# EasyEDA Pro project ProProject_Hi3861_v2.1_2024-07-26.epro, schematic Schematic3

## Sheets
1 P1: Create Date: 2024-07-16; Page Name: P1; Project Name: Hi3861_v2.1; Schematic Name: Schematic3; Update Date: 2024-07-16; Company: 嘉立创EDA; Page Size: A4; Version: V1.0
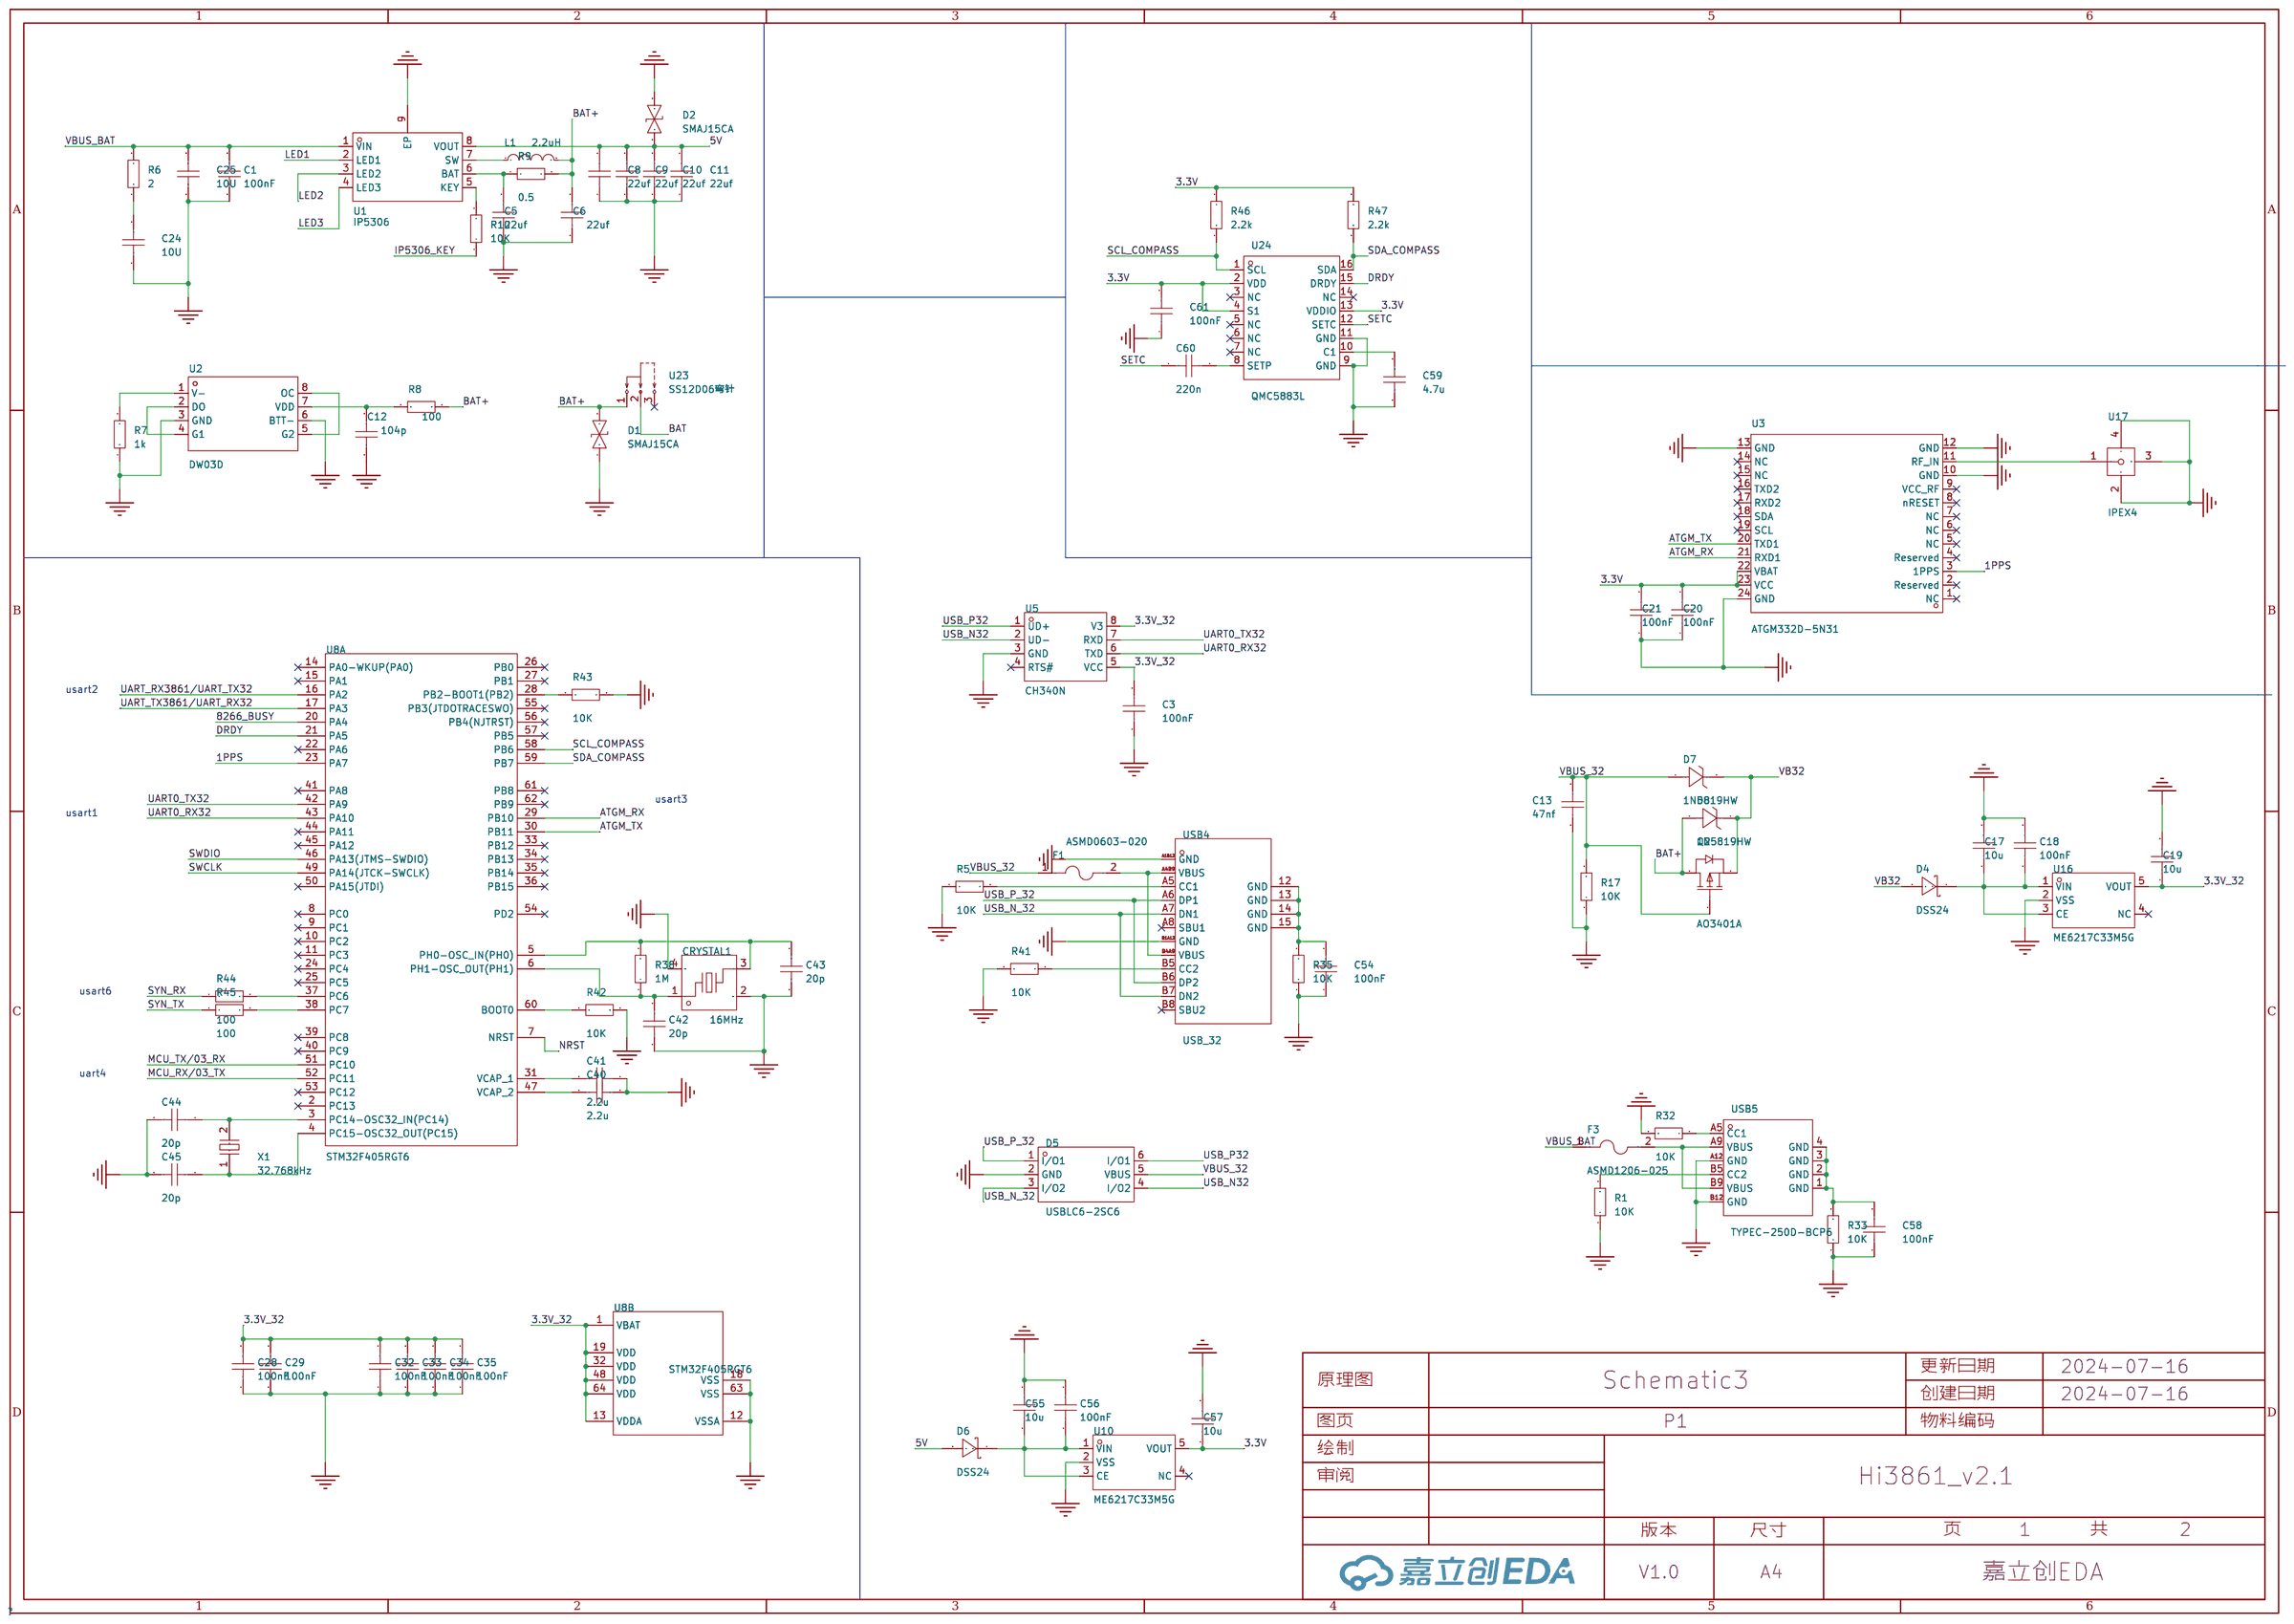
[diagram p4: P1]
2 P2: Page Name: P2
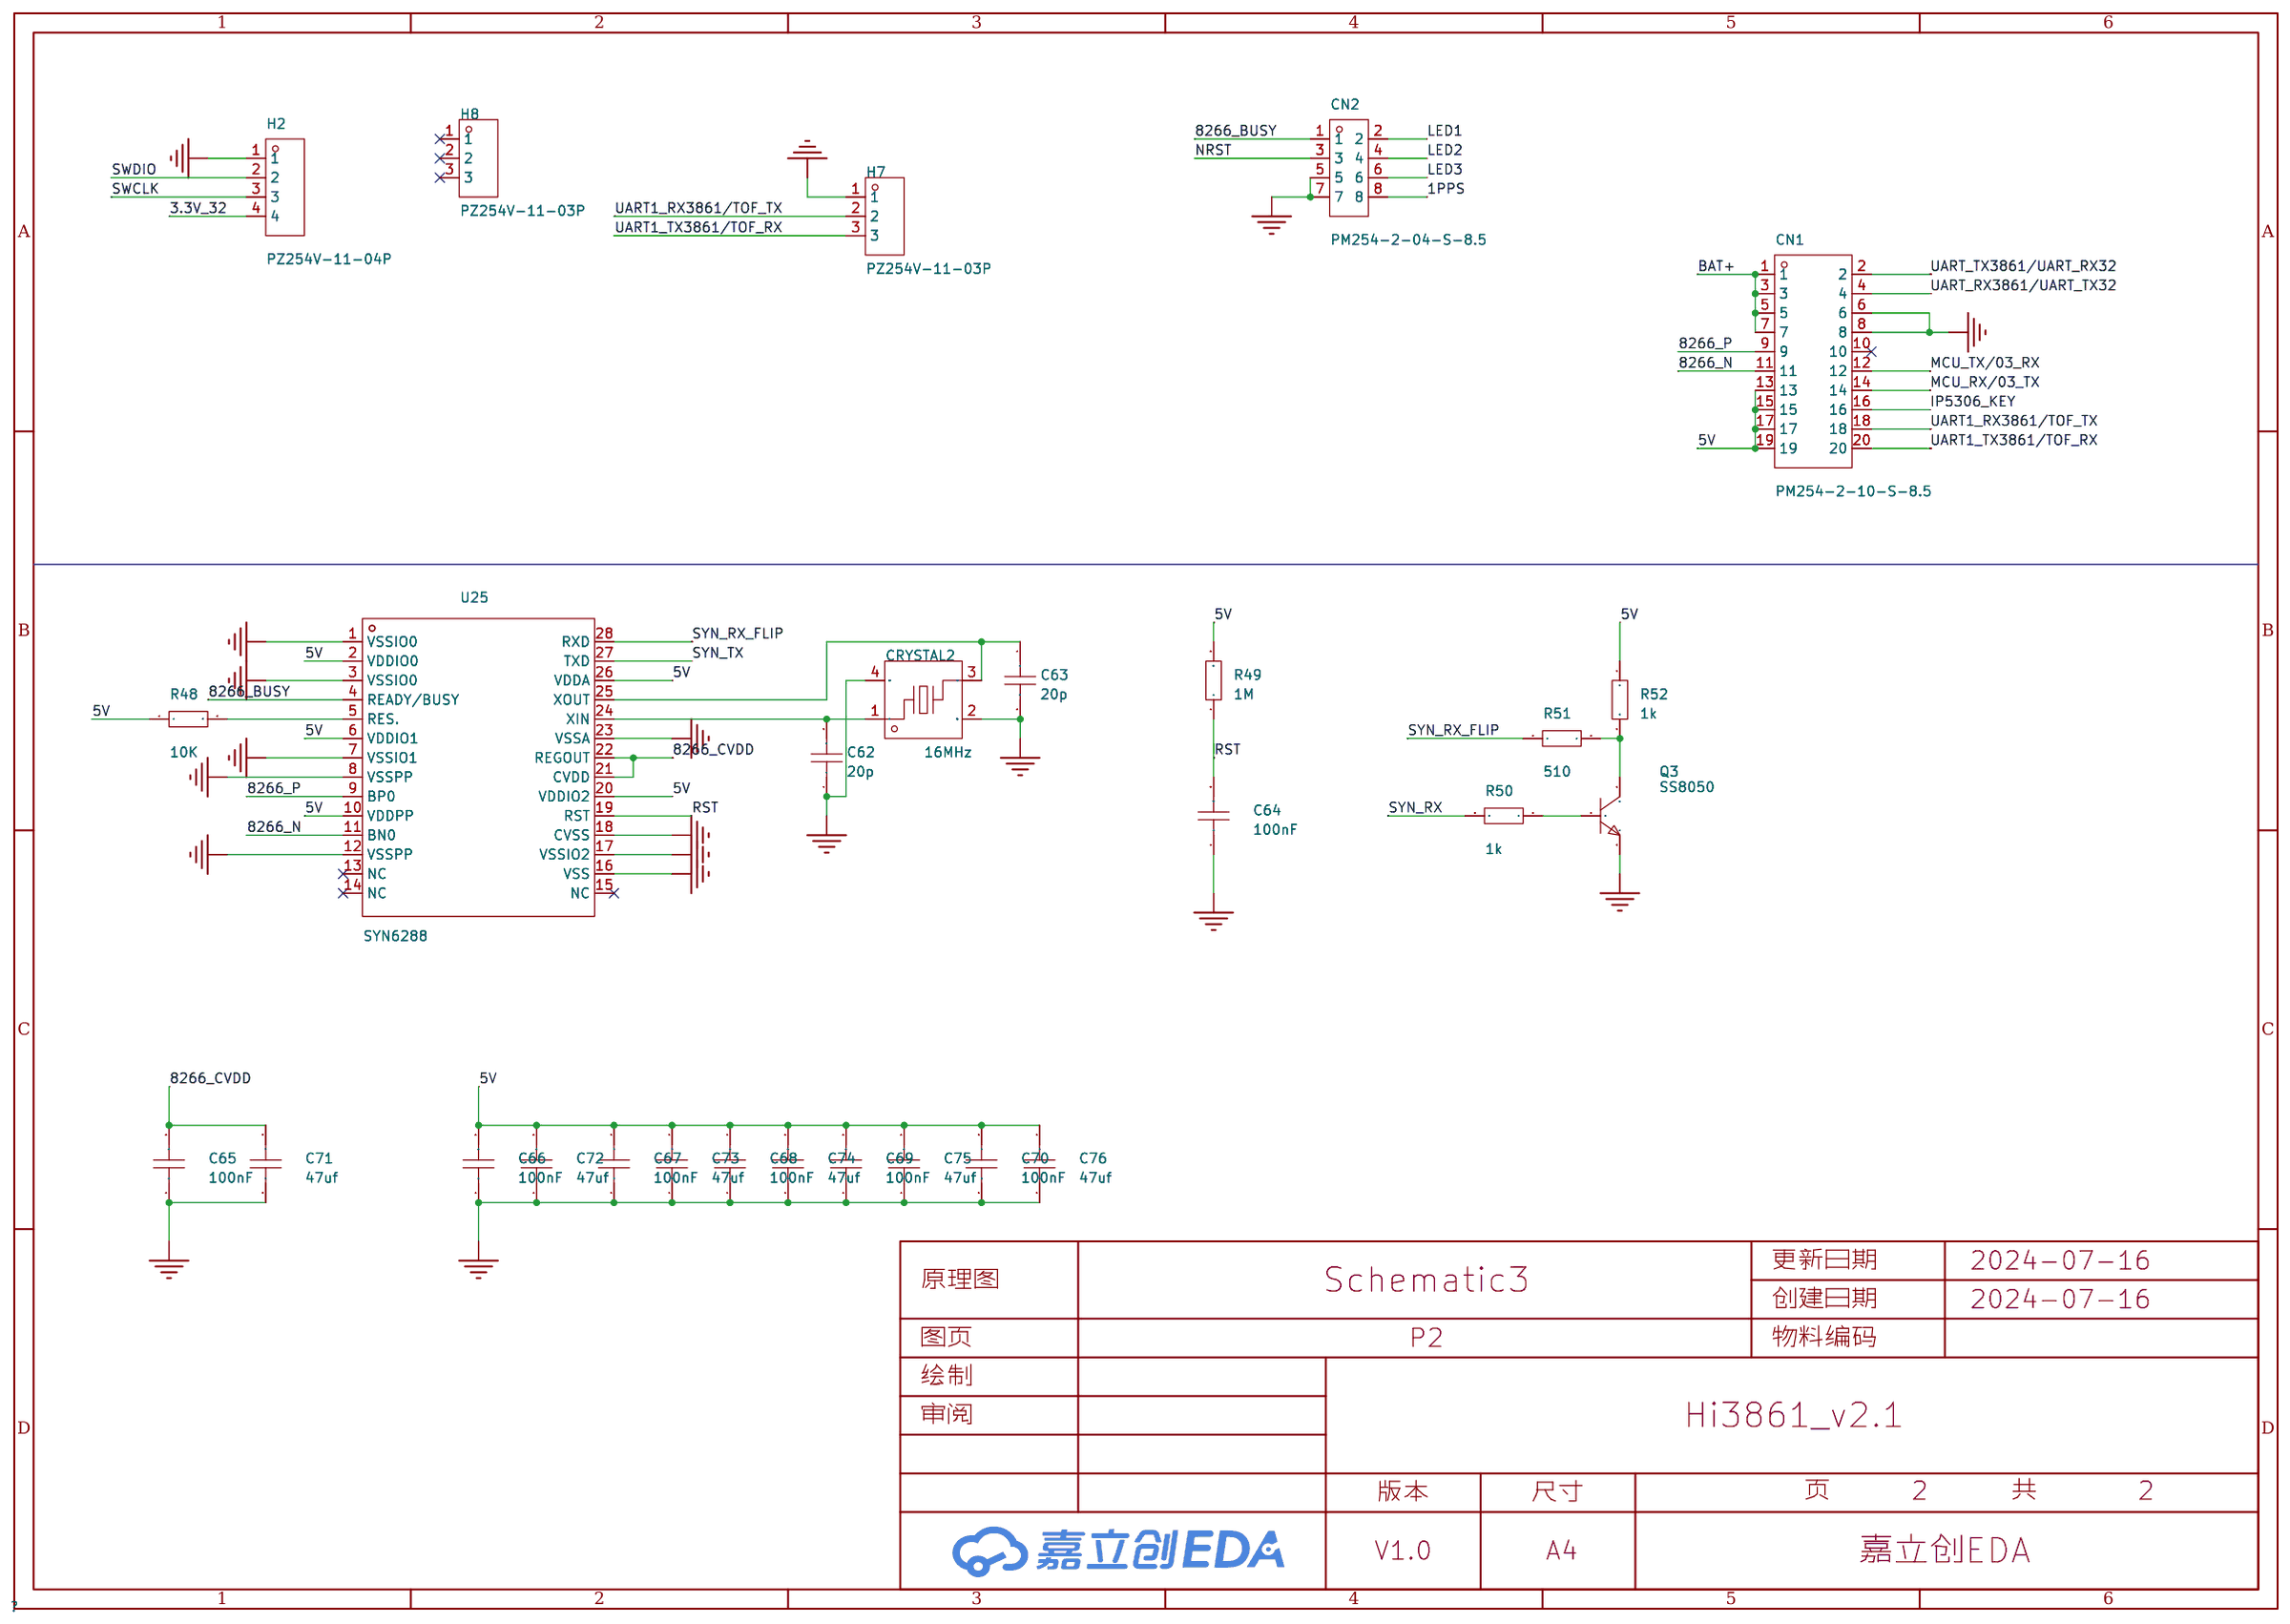
[diagram p5: P2]

## Parts
sheet P1
C1  100nF  [C0402]
C3  100nF  [C0402]
C5  22uf  [C1206]
C6  22uf  [C1206]
C8  22uf  [C1206]
C9  22uf  [C1206]
C10  22uf  [C1206]
C11  22uf  [C1206]
C12  104p  [C0402]
C13  47nf  [C0402]
C17  10u  [C0402]
C18  100nF  [C0402]
C19  10u  [C0402]
C20  100nF  [C0402]
C21  100nF  [C0402]
C24  10U  [C0603]
C25  10U  [C0603]
C28  100nF  [C0402]
C29  100nF  [C0402]
C32  100nF  [C0402]
C33  100nF  [C0402]
C34  100nF  [C0402]
C35  100nF  [C0402]
C40  2.2u  [C0402]
C41  2.2u  [C0402]
C42  20p  [C0402]
C43  20p  [C0402]
C44  20p  [C0402]
C45  20p  [C0402]
C54  100nF  [C0402]
C55  10u  [C0402]
C56  100nF  [C0402]
C57  10u  [C0402]
C58  100nF  [C0402]
C59  4.7u  [C0603]
C60  220n  [C0402]
C61  100nF  [C0402]
CRYSTAL1  16MHz  [CRYSTAL-SMD_4P-L3.2-W2.5-BL_SIT8008BI]
D1  SMAJ15CA  [SMA_L4.3-W2.7-LS5.1-BI]
D2  SMAJ15CA  [SMA_L4.3-W2.7-LS5.1-BI]
D4  DSS24  [SOD-123_L2.8-W1.8-LS3.7-RD]
D5  USBLC6-2SC6  [SOT-23-6_L2.9-W1.6-P0.95-LS2.8-BL]
D6  DSS24  [SOD-123_L2.8-W1.8-LS3.7-RD]
D7  1N5819HW  [SOD-123_L2.7-W1.6-LS3.7-RD-1]
D8  1N5819HW  [SOD-123_L2.7-W1.6-LS3.7-RD-1]
F1  ASMD0603-020  [F0603]
F3  ASMD1206-025  [F1206]
L1  2.2uH  [IND-SMD_L7.0-W6.6_MCW-0650-220]
Q2  AO3401A  [SOT-23_L2.9-W1.3-P1.90-LS2.4-BR]
R1  10K  [R0402]
R5  10K  [R0402]
R6  2  [R0402]
R7  1k  [R0402]
R8  100  [R0402]
R9  0.5  [R0603]
R10  10K  [R0603]
R17  10K  [R0402]
R32  10K  [R0402]
R33  10K  [R0402]
R35  10K  [R0402]
R38  1M  [R0402]
R41  10K  [R0402]
R42  10K  [R0402]
R43  10K  [R0402]
R44  100  [R0402]
R45  10K  [R0402]
R46  2.2k  [R0402]
R47  2.2k  [R0402]
U1  IP5306  [ESOP-8_L4.9-W3.9-P1.27-LS6.0-BL-EP]
U2  DW03D  [TSSOP-8_L4.4-W3.0-P0.65-LS6.4-BL]
U3  ATGM332D-5N31  [GSM-SMD_ATGM332D-5N31]
U5  CH340N  [SOP-8_L4.9-W3.9-P1.27-LS6.0-BL]
U8  STM32F405RGT6  [LQFP-64_L10.0-W10.0-P0.50-LS12.0-BL]  (sections 1,2)
U10  ME6217C33M5G  [SOT-23-5_L3.0-W1.7-P0.95-LS2.8-BR]
U16  ME6217C33M5G  [SOT-23-5_L3.0-W1.7-P0.95-LS2.8-BR]
U17  IPEX4  [IPEX-SMD_4P-L1.8-W1.7-LS2.0-1]
U23  SS12D06弯针  [SW-TH_3P-SS12D06-1]
U24  QMC5883L  [LGA-16_L3.0-W3.0-P0.50-BL_SQ]
USB4  USB_32  [USB-SMD_TYPEC-16PIN]
USB5  TYPEC-250D-BCP6  [USB-C-SMD_TYPEC-250D-BCP6]
X1  32.768kHz  [CRYSTAL-SMD_L3.2-W1.5-1]
sheet P2
C62  20p  [C0402]
C63  20p  [C0402]
C64  100nF  [C0402]
C65  100nF  [C0402]
C66  100nF  [C0402]
C67  100nF  [C0402]
C68  100nF  [C0402]
C69  100nF  [C0402]
C70  100nF  [C0402]
C71  47uf  [C1206]
C72  47uf  [C1206]
C73  47uf  [C1206]
C74  47uf  [C1206]
C75  47uf  [C1206]
C76  47uf  [C1206]
CN1  PM254-2-10-S-8.5  [HDR-SMD_20P-P2.54-V-F-R2-C10-S2.54-LS7.1]
CN2  PM254-2-04-S-8.5  [HDR-SMD_8P-P2.54-V-F-R2-C4-S7.1]
CRYSTAL2  16MHz  [CRYSTAL-SMD_4P-L3.2-W2.5-BL_SIT8008BI]
H2  PZ254V-11-04P  [HDR-TH_4P-P2.54-V-M]
H7  PZ254V-11-03P  [HDR-TH_3P-P2.54-V-M]
H8  PZ254V-11-03P  [HDR-TH_3P-P2.54-V-M]
Q3  SS8050  [SOT-23-3_L2.9-W1.3-P1.90-LS2.4-BR]
R48  10K  [R0402]
R49  1M  [R0402]
R50  1k  [R0402]
R51  510  [R0402]
R52  1k  [R0402]
U25  SYN6288  [SSOP-28_L10.2-W5.3-P0.65-LS7.8-BL]

## Library data of the parts
C1 C3 C12 C13 C17-C21 C28 C29 C32-C35 C40-C45 C54-C58 C60-C70 = CAP_0402: Supplier Footprint: 0402
C5 C6 C8-C11 C71-C76 = CAP_1206: Supplier Footprint: 1206
C24 C25 C59 = CAP_0603: Supplier Footprint: 0603
CRYSTAL1 CRYSTAL2 = CF4008M00012001: 晶振类型:贴片晶振;频率:8MHz;常温频差:±10ppm;外接负载电容:12pF;频率稳定度(全温):±30ppm;; LCSC Part Name: 8MHz ±10ppm 12pF; Supplier Part: C7294546; Manufacturer: HUAXIN(华昕); Supplier Footprint: SMD-3225-4P; Datasheet: https://atta.szlcsc.com/upload/public/pdf/source/20230614/403FD538918E19EFAFACD07D4A487DFF.pdf; Supplier: LCSC; Crystal Type: 贴片晶振; Normal temperature Frequency Tolerance: ±10ppm; External load capacitor: 12pF; Frequency Stability(Full temperature range): ±30ppm; Equivalent Series Resistance (ESR): 40Ω; Operating Temperature: -40℃~+85℃
D1 D2 = SMAJ15CA_C908195: 反向截止电压(Vrwm):15V;最大钳位电压:24.4V;峰值脉冲电流(Ipp)@10/1000us:16.4A;击穿电压:16.7V;; LCSC Part Name: 双向TVS 15V截止 16.4A峰值脉冲; Supplier Part: C908195; Manufacturer: FUXINSEMI(富芯森美); Supplier Footprint: SMA(DO-214AC); Datasheet: https://atta.szlcsc.com/upload/public/pdf/source/20201023/C908195_37902766E86D5E1EA357B63C628FE5CE.pdf; Supplier: LCSC; Reverse Stand-Off Voltage (Vrwm): 15V; Maximum Clamping Voltage: 24.4V; Peak Pulse Current (Ipp)@10/1000us: 16.4A; Breakdown Voltage: 16.7V; Reverse Leakage Current (Ir): 5uA; Type: TVS
D4 D6 = DSS24: 正向压降(Vf):550mV@2A;直流反向耐压(Vr):40V;平均整流电流(Io):2A;; LCSC Part Name: 电压:40V 电流:2A; Supplier Part: C511865; Manufacturer: BORN(伯恩半导体); Supplier Footprint: SOD-123; Datasheet: https://atta.szlcsc.com/upload/public/pdf/source/20200413/C511865_530A4A8DFA4BF76EA49400B00C28BC33.pdf; Supplier: LCSC; Forward Voltage (Vf@If): 550mV@2A; Reverse Voltage (Vr): 40V; Average Rectified Current (Io): 2A
D5 = USBLC6-2SC6: 最大钳位电压:15V;击穿电压:6V;; Supplier Part: C2687116; Manufacturer: UMW(友台半导体); Supplier Footprint: SOT-23-6; JLCPCB Part Class: 扩展库; Datasheet: https://atta.szlcsc.com/upload/public/pdf/source/20231109/512642D850D9873E7C519F71E85B9A10.pdf; Supplier: LCSC; Maximum Clamping Voltage: 15V; Breakdown Voltage: 6V; Number of Lines: 双路; Type: ESD
D7 D8 = 1N5819HW_C5439970: Supplier Part: C5439970; Manufacturer: BORN(伯恩半导体); Supplier Footprint: SOD-123; JLCPCB Part Class: 扩展库; Supplier: LCSC
F1 = ASMD0603-020: 最大电压:9V;最大电流:40A;保持电流:200mA;跳闸电流:500mA;; LCSC Part Name: 9V 200mA 0603自恢复; Supplier Part: C135321; Manufacturer: JDTfuse(集电通); Supplier Footprint: 0603; JLCPCB Part Class: 扩展库; Datasheet: https://atta.szlcsc.com/upload/public/pdf/source/20230515/E3BD72A3B3566E5D91D9E10B82E096BB.pdf; Supplier: LCSC; Operating Voltage (Max): 9V; Current Rating (Max): 40A; Hold Current: 200mA; Trip Current: 500mA; Power Dissipation: 500mW; Resistance - Initial (Ri) (Min): 550mΩ; Resistance - Post Trip (R1) (Max): 3.5Ω; Maximum Time to Trip: 600ms; Operating Temperature: -40℃~+85℃
F3 = ASMD1206-025: 最大电压:16V;最大电流:100A;保持电流:250mA;跳闸电流:500mA;; LCSC Part Name: 16V 250mA 1206自恢复; Supplier Part: C135336; Manufacturer: JDTfuse(集电通); Supplier Footprint: 1206; JLCPCB Part Class: 扩展库; Datasheet: https://atta.szlcsc.com/upload/public/pdf/source/20230515/057C807831823160B78244CFBDC62EBE.pdf; Supplier: LCSC; Operating Voltage (Max): 16V; Current Rating (Max): 100A; Hold Current: 250mA; Trip Current: 500mA; Power Dissipation: 600mW; Resistance - Initial (Ri) (Min): 350mΩ; Resistance - Post Trip (R1) (Max): 2.5Ω; Maximum Time to Trip: 80ms; Operating Temperature: -40℃~+85℃
L1 = MCW-0650-220-N2: 电感值:22uH;精度:±20%;额定电流:2.6A;; LCSC Part Name: 22uH ±20%; Supplier Part: C177257; Manufacturer: Hk-hotline(合泰盟方); Supplier Footprint: SMD,6.6x7mm; Datasheet: https://atta.szlcsc.com/upload/public/pdf/source/20180126/C177257_15169518534351308687.pdf; Supplier: LCSC; Tolerance: ±20%; Rated Current: 2.6A; DC Resistance (DCR): 140mΩ
Q2 = AO3401A_C15127: 类型:1个P沟道;漏源电压(Vdss):30V;连续漏极电流(Id):4A;功率(Pd):1.4W;导通电阻(RDS(on)@Vgs,Id):44mΩ@10V,4.3A;阈值电压(Vgs(th)@Id):1.3V@250uA;; LCSC Part Name: 1个P沟道 耐压:30V 电流:4A; Supplier Part: C15127; Manufacturer: AOS; Supplier Footprint: SOT-23; JLCPCB Part Class: 基础库; Datasheet: https://atta.szlcsc.com/upload/public/pdf/source/20160507/1462613609053.pdf; Supplier: LCSC; Type: 1个P沟道; Drain Source Voltage (Vdss): 30V; Continuous Drain Current (Id): 4A; Power Dissipation (Pd): 1.4W; Drain Source On Resistance (RDS(on)@Vgs,Id): 44mΩ@10V,4.3A; Gate Threshold Voltage (Vgs(th)@Id): 1.3V@250uA; Total Gate Charge (Qg@Vgs): 12.2nC@4.5V; Input Capacitance (Ciss@Vds): 1.2nF@15V; Operating Temperature: -55℃~+150℃@(Tj)
R1 R5-R8 R17 R32 R33 R35 R38 R41-R52 = Res_0402: Supplier Footprint: 0402
R9 R10 = Res_0603: Supplier Footprint: 0603
U1 = IP5306: 2.1A充电2.4A放电高集成度移动电源SOC; Supplier Part: C181692; Manufacturer: INJOINIC(英集芯); Supplier Footprint: ESOP-8; JLCPCB Part Class: 扩展库; Datasheet: https://atta.szlcsc.com/upload/public/pdf/source/20190627/C384572_9925B3DDC4041BC6108E5AB46A2A0AB1.pdf; Supplier: LCSC
U2 = DW03D: 二合一锂电池保护芯片; Supplier Part: C82200; Manufacturer: FM(富满); Supplier Footprint: TSSOP-8; Datasheet: https://atta.szlcsc.com/upload/public/pdf/source/20170814/C82200_1502678439162886029.pdf; Supplier: LCSC
U3 = ATGM332D-5N31: BDS/GNSS 全星座定位导航模块; LCSC Part Name: BDS/GNSS 全星座定位导航模块; Supplier Part: C128659; Manufacturer: 杭州中科微; Supplier Footprint: SMD,12.2x16mm; Datasheet: https://atta.szlcsc.com/upload/public/pdf/source/20171221/C128660_15138310154131195212.pdf; Supplier: LCSC
U5 = CH340N: LCSC Part Name: USB转串口芯片 CH340; Supplier Part: C2977777; Manufacturer: WCH(南京沁恒); Supplier Footprint: SOP-8; Datasheet: https://atta.szlcsc.com/upload/public/pdf/source/20230530/6E401E9554E9F5311886CC8B3F89B62E.pdf; Supplier: LCSC
U8 = STM32F405RGT6: CPU内核:CM4;程序存储容量:1MB;RAM总容量:192KB;GPIO端口数量:51;工作电压范围:1.8V~3.6V;CPU最大主频:168MHz;程序存储器类型:FLASH;; Supplier Part: C15742; Manufacturer: ST(意法半导体); Supplier Footprint: LQFP-64(10x10); Datasheet: https://atta.szlcsc.com/upload/public/pdf/source/20140801/1457707197138.pdf; Supplier: LCSC; CPU Core: CM4; Program Storage Size: 1MB; RAM Size: 192KB; GPIO Ports Number: 51; Operating Voltage Range: 1.8V~3.6V; CPU Maximum Speed: 168MHz; Program Memory Type: FLASH; Operating Temperature Range: -40℃~+85℃; ADC (Bit): 12bit; DAC (Bit): 12bit; Universal Serial Bus: 有; Peripheral/Function: DMA；LCD/LED驱动；PWM; Watchdog: 有; Infrared Data Association: 有; Low-Voltage Detect: 有; LCD Module: 有; Direct Memory Access: 有; Internal Oscillator: 有
U10 U16 = ME6217C33M5G: 输出类型:固定;最大输入电压:7V;输出电压:3.3V;最大输出电流:800mA;电源纹波抑制比(PSRR):65dB@(1kHz);输出极性:正极;; LCSC Part Name: 输入7V 输出3.3V 800mA; Supplier Part: C427602; Manufacturer: MICRONE(南京微盟); Supplier Footprint: SOT-23-5; JLCPCB Part Class: 扩展库; Datasheet: https://atta.szlcsc.com/upload/public/pdf/source/20190910/C427602_D4B9162A2E9D9EF57C60010DFDECEF37.pdf; Supplier: LCSC; Output Type: 固定; Maximum Input Voltage: 7V; Output Voltage: 3.3V; MAX Output Current: 800mA; Power Supply Rejection Ratio (PSRR): 65dB@(1kHz); Dropout Voltage: 180mV@(300mA); Output Polarity: 正极; Number of Outputs: 1
U17 = IPEX4: Supplier Part: C9900016189; JLCPCB Part Class: 扩展库; Supplier: LCSC
U23 = SS12D06弯针: Supplier Part: C9900027365; Supplier Footprint: THrough hole; JLCPCB Part Class: 扩展库; Supplier: LCSC
U24 = QMC5883L: LCSC Part Name: 三轴磁传感器; Supplier Part: C976032; Manufacturer: QST(上海矽睿); Supplier Footprint: LGA-16(3x3); JLCPCB Part Class: 扩展库; Datasheet: https://atta.szlcsc.com/upload/public/pdf/source/20201217/C976032_5B9A2F3901E175046CBA037B1F18A1F2.pdf; Supplier: LCSC
USB4 = CONNECTOR,USB,TYPEC,RTANG,16PIN: Supplier Part: C9900022254; Supplier Footprint: USBTypeC; JLCPCB Part Class: 扩展库; Supplier: LCSC
USB5 = TYPEC-250D-BCP6: 连接器类型:Type-C;标准:USB 3.1;公母:母;端口数量:1;触点数量:6P;安装方式:卧贴;额定电流 - 电源:3A;工作温度范围:-25℃~+85℃;焊接温度(最大值):260℃;; LCSC Part Name: Type-C 母 卧贴; Supplier Part: C720626; Manufacturer: XUNPU(讯普); Supplier Footprint: SMD; JLCPCB Part Class: 扩展库; Datasheet: https://atta.szlcsc.com/upload/public/pdf/source/20200812/C720626_0B3D9525FB9C6D818696E28704B18234.pdf; Supplier: LCSC; Connector Type: Type-C; Standard: USB 3.1; Gender: 母; Number of Ports: 1; Number of Contacts: 6P; Mounting Style: 卧贴; Current Rating - Power (Max): 3A; Operating Temperature Range: -25℃~+85℃; Welding Temperature (Max): 260℃
X1 = FC-135 32.7680KA-AG5: 晶振类型:贴片晶振;频率:32.768kHz;常温频差:±20ppm;外接负载电容:7pF;; LCSC Part Name: 32.768kHz ±20ppm 7pF; Supplier Part: C440693; Manufacturer: EPSON(爱普生); Supplier Footprint: SMD3215-2P; Datasheet: https://atta.szlcsc.com/upload/public/pdf/source/20230606/9F54EAFA52F692581482D26E2391AEA1.pdf; Supplier: LCSC; Crystal Type: 贴片晶振; Normal temperature Frequency Tolerance: ±20ppm; External load capacitor: 7pF; Equivalent Series Resistance (ESR): 70kΩ; Operating Temperature: -40℃~+85℃
CN1 = PM254-2-10-S-8.5: 插孔结构:2x10P;间距:2.54mm;行距:2.54mm;圆孔/方孔:方孔;安装类型:立贴;排数:双排;总孔位数:20P;额定电流:3A;插孔方向:顶部;塑高:8.5mm;触头材质:铜合金;工作温度范围:-40℃~+105℃;焊接温度(最大值):260℃@5S;; LCSC Part Name: 2x10P 间距:2.54mm 立贴; Supplier Part: C3975155; Manufacturer: HCTL(华灿天禄); Supplier Footprint: SMD,P=2.54mm; Datasheet: https://atta.szlcsc.com/upload/public/pdf/source/20230609/7C6F8D8E301C6BBC8F19D55951C36597.pdf; Supplier: LCSC; Holes Structure: 2x10P; Pitch: 2.54mm; Row Spacing: 2.54mm; Circular Hole / Square Hole: 方孔; Mounting Type: 立贴; Number of Rows: 双排; Number of Holes: 20P; Current Rating (Max): 3A; Holes Direction: 顶部; Insulation Height: 8.5mm; Contact Material: 铜合金; Operating Temperature Range: -40℃~+105℃; Soldering Temperature(Max): 260℃@5S
CN2 = PM254-2-04-S-8.5: 插孔结构:2x4P;间距:2.54mm;行距:2.54mm;圆孔/方孔:方孔;安装类型:立贴;排数:双排;总孔位数:8P;额定电流:3A;插孔方向:顶部;塑高:8.5mm;触头材质:铜合金;工作温度范围:-40℃~+105℃;焊接温度(最大值):260℃@5S;; LCSC Part Name: 2x4P 间距:2.54mm 立贴; Supplier Part: C3975149; Manufacturer: HCTL(华灿天禄); Supplier Footprint: SMD,P=2.54mm; Datasheet: https://atta.szlcsc.com/upload/public/pdf/source/20230609/7C6F8D8E301C6BBC8F19D55951C36597.pdf; Supplier: LCSC; Holes Structure: 2x4P; Pitch: 2.54mm; Row Spacing: 2.54mm; Circular Hole / Square Hole: 方孔; Mounting Type: 立贴; Number of Rows: 双排; Number of Holes: 8P; Current Rating (Max): 3A; Holes Direction: 顶部; Insulation Height: 8.5mm; Contact Material: 铜合金; Operating Temperature Range: -40℃~+105℃; Soldering Temperature(Max): 260℃@5S
H2 = PZ254V-11-04P: 插针结构:1x4P;间距:2.54mm;行距:-;圆针/方针:方针;安装类型:直插;排数:单排;总PIN位数:4P;额定电流:3A;额定电压:250V;配合针长度:6mm;塑高:2.5mm;端接针长度:3mm;触头材质:-;工作温度范围:-40℃~+105℃;颜色:黑色;; LCSC Part Name: 间距:2.54mm 1x4P 直插 方针; Supplier Part: C2691448; Manufacturer: XFCN(兴飞); Supplier Footprint: 插件,P=2.54mm; Datasheet: https://atta.szlcsc.com/upload/public/pdf/source/20200309/C492403_F9F19131791D08044AD4F84F8E751A34.pdf; Supplier: LCSC; Pin Structure: 1x4P; Pitch: 2.54mm; Circluar Pins/Square Pins: 方针; Mounting Type: 直插; Number of Rows: 单排; Number of Pins: 4P; Current Rating (Max): 3A; Voltage Rating (Max): 250V; Length of Mating Pin: 6mm; Insulation Height: 2.5mm; Length of End Connection Pin: 3mm; Operating Temperature Range: -40℃~+105℃; Color: 黑色
H7 H8 = PZ254V-11-03P: 插针结构:1x3P;间距:2.54mm;行距:-;圆针/方针:方针;安装类型:直插;排数:单排;总PIN位数:3P;额定电流:3A;额定电压:250V;配合针长度:6mm;塑高:2.5mm;端接针长度:3mm;工作温度范围:-40℃~+105℃;颜色:黑色;; LCSC Part Name: 间距:2.54mm 1x3P 直插 方针; Supplier Part: C2937625; Manufacturer: XFCN(兴飞); Supplier Footprint: 插件,P=2.54mm; Datasheet: https://atta.szlcsc.com/upload/public/pdf/source/20200309/C492402_8335C3D49C4E4C618838D59BB1D024C1.pdf; Supplier: LCSC; Pin Structure: 1x3P; Pitch: 2.54mm; Circluar Pins/Square Pins: 方针; Mounting Type: 直插; Number of Rows: 单排; Number of Pins: 3P; Current Rating (Max): 3A; Voltage Rating (Max): 250V; Length of Mating Pin: 6mm; Insulation Height: 2.5mm; Length of End Connection Pin: 3mm; Operating Temperature Range: -40℃~+105℃; Color: 黑色
Q3 = SS8050: LCSC Part Name: NPN 25V 1.5A 120-400 SOT-23; Supplier Part: C2931717; Manufacturer: Doeshare(德芯); Supplier Footprint: SOT-23; JLCPCB Part Class: 扩展库; Datasheet: https://atta.szlcsc.com/upload/public/pdf/source/20220106/99F9A3DFCBDD91265C711555CE6390BF.pdf; Supplier: LCSC
U25 = SYN6288: 语音合成芯片，用于语音播报，语音提示。; Supplier Part: C123765; Manufacturer: 宇音天下; Supplier Footprint: SSOP-28-208mil; JLCPCB Part Class: 扩展库; Datasheet: https://atta.szlcsc.com/upload/public/pdf/source/20170810/C123765_1502335211916879745.pdf; Supplier: LCSC

## Nets
3.3V: C20.2 C21.2 C57.1 C61.2 R46.2 R47.2 U3.22(VBAT) U3.23(VCC) U10.5(VOUT) U24.2(VDD) U24.4(S1) U24.13(VDDIO)
3.3V_32: C3.2 C19.1 C28.2 C29.2 C32.2 C33.2 C34.2 C35.2 H2.4 U5.5(VCC) U5.8(V3) U8.1(VBAT) U8.13(VDDA) U8.19(VDD) U8.32(VDD) U8.48(VDD) U8.64(VDD) U16.5(VOUT)
5V: C8.2 C9.2 C10.2 C11.2 C66.2 C67.2 C68.2 C69.2 C70.2 C72.2 C73.2 C74.2 C75.2 C76.2 CN1.13 CN1.15 CN1.17 CN1.19 D2.1 D6.2(A) R48.1 R49.2 R52.1 U1.8(VOUT) U25.2(VDDIO0) U25.6(VDDIO1) U25.10(VDDPP) U25.20(VDDIO2) U25.26(VDDA)
GND: C1.1 C3.1 C5.1 C6.1 C8.1 C9.1 C10.1 C11.1 C12.1 C13.1 C17.2 C18.2 C19.2 C20.1 C21.1 C24.1 C25.1 C28.1 C29.1 C32.1 C33.1 C34.1 C35.1 C40.1 C41.1 C42.1 C43.2 C44.2 C45.2 C54.1 C55.2 C56.2 C57.2 C58.1 C59.1 C61.1 C62.1 C63.2 C64.1 C65.1 C66.1 C67.1 C68.1 C69.1 C70.1 C71.1 C72.1 C73.1 C74.1 C75.1 C76.1 CN1.6 CN1.8 CN2.5 CN2.7 CRYSTAL1.2(GND) CRYSTAL1.4(GND) CRYSTAL2.2(GND) CRYSTAL2.4(GND) D1.1 D2.2 D5.2(GND) H2.1 H7.1 Q3.2(E) R1.1 R5.1 R7.1 R17.1 R32.2 R33.1 R35.1 R41.1 R42.2 R43.2 U1.9(EP) U2.3(GND) U2.6(BTT-) U3.10(GND) U3.12(GND) U3.13(GND) U3.24(GND) U5.3(GND) U8.12(VSSA) U8.18(VSS) U8.63(VSS) U10.2(VSS) U16.2(VSS) U17.2 U17.3 U17.4 U24.9(GND) U24.11(GND) U25.1(VSSIO0) U25.3(VSSIO0) U25.7(VSSIO1) U25.8(VSSPP) U25.12(VSSPP) U25.16(VSS) U25.17(VSSIO2) U25.18(CVSS) U25.23(VSSA) USB4.A1B12(GND) USB4.B1A12(GND) USB5.A12(GND) USB5.B12(GND)
VBUS_32: C13.2 D5.5(VBUS) D7.2(A) F1.1 Q2.1(G) R17.2
VBUS_BAT: C1.2 C25.2 F3.1 R6.2 U1.1(VIN)
1PPS: CN2.8 U3.3(1PPS) U8.23(PA7)
8266_BUSY: CN2.1 U8.20(PA4) U25.4(READY/BUSY)
8266_CVDD: C65.2 C71.2 U25.21(CVDD) U25.22(REGOUT)
8266_N: CN1.11 U25.11(BN0)
8266_P: CN1.9 U25.9(BP0)
ATGM_RX: U3.21(RXD1) U8.29(PB10)
ATGM_TX: U3.20(TXD1) U8.30(PB11)
BAT: U23.2
BAT+: C6.2 CN1.1 CN1.3 CN1.5 CN1.7 D1.2 D8.2(A) L1.2 Q2.3(D) R8.2 R9.2 U23.1
DRDY: U8.21(PA5) U24.15(DRDY)
IP5306_KEY: CN1.16 R10.1
LED1: CN2.2 U1.2(LED1)
LED2: CN2.4 U1.3(LED2)
LED3: CN2.6 U1.4(LED3)
MCU_RX/03_TX: CN1.14 U8.52(PC11)
MCU_TX/03_RX: CN1.12 U8.51(PC10)
NRST: CN2.3 U8.7(NRST)
RST: C64.2 R49.1 U25.19(RST)
SCL_COMPASS: R46.1 U8.58(PB6) U24.1(SCL)
SDA_COMPASS: R47.1 U8.59(PB7) U24.16(SDA)
SETC: C60.1 U24.12(SETC)
SWCLK: H2.3 U8.49(PA14(JTCK-SWCLK))
SWDIO: H2.2 U8.46(PA13(JTMS-SWDIO))
SYN_RX: R44.1 R50.2
SYN_RX_FLIP: R51.1 U25.28(RXD)
SYN_TX: R45.1 U25.27(TXD)
UART0_RX32: U5.6(TXD) U8.43(PA10)
UART0_TX32: U5.7(RXD) U8.42(PA9)
UART1_RX3861/TOF_TX: CN1.18 H7.2
UART1_TX3861/TOF_RX: CN1.20 H7.3
UART_RX3861/UART_TX32: CN1.4 U8.16(PA2)
UART_TX3861/UART_RX32: CN1.2 U8.17(PA3)
USB_N32: D5.4(I/O2) U5.2(UD-)
USB_N_32: D5.3(I/O2) USB4.A7(DN1) USB4.B7(DN2)
USB_P32: D5.6(I/O1) U5.1(UD+)
USB_P_32: D5.1(I/O1) USB4.A6(DP1) USB4.B6(DP2)
VB32: D4.2(A) D7.1(K) D8.1(K) Q2.2(S)
$1N601: L1.1 U1.7(SW)
$1N606: C5.2 R9.1 U1.6(BAT)
$1N607: C24.2 R6.1
$1N610: U2.5(G2) U2.8(OC)
$1N612: R7.2 U2.1(V-)
$1N613: C12.2 R8.1 U2.7(VDD)
$1N615: U2.2(DO) U2.4(G1)
$1N1198: R10.2 U1.5(KEY)
$1N2665: C41.2 U8.31(VCAP_1)
$1N2666: C40.2 U8.47(VCAP_2)
$1N2670: R42.1 U8.60(BOOT0)
$1N2672: R43.1 U8.28(PB2-BOOT1(PB2))
$1N2674: C42.2 CRYSTAL1.1 R38.1 U8.6(PH1-OSC_OUT(PH1))
$1N2677: C43.1 CRYSTAL1.3 R38.2 U8.5(PH0-OSC_IN(PH0))
$1N2678: C45.1 U8.4(PC15-OSC32_OUT(PC15)) X1.1
$1N2679: C44.1 U8.3(PC14-OSC32_IN(PC14)) X1.2(GND)
$1N3817: U3.11(RF_IN) U17.1
$1N4291: R41.2 USB4.B5(CC2)
$1N4294: R5.2 USB4.A5(CC1)
$1N4295: F1.2 USB4.A4B9(VBUS) USB4.B4A9(VBUS)
$1N4303: C54.2 R35.2 USB4.12(GND) USB4.13(GND) USB4.14(GND) USB4.15(GND)
$1N4790: C17.1 C18.1 D4.1(C) U16.1(VIN) U16.3(CE)
$1N4991: C55.1 C56.1 D6.1(C) U10.1(VIN) U10.3(CE)
$1N5567: F3.2 USB5.A9(VBUS) USB5.B9(VBUS)
$1N5570: R1.2 USB5.B5(CC2)
$1N5572: R32.1 USB5.A5(CC1)
$1N5574: C58.2 R33.2 USB5.1(GND) USB5.2(GND) USB5.3(GND) USB5.4(GND)
$1N5749: R44.2 U8.37(PC6)
$1N5781: R45.2 U8.38(PC7)
$1N9722: C59.2 U24.10(C1)
$1N9831: C60.2 U24.8(SETP)
$2N3356: R48.2 U25.5(RES.)
$2N3459: C62.2 CRYSTAL2.1 U25.24(XIN)
$2N3469: C63.1 CRYSTAL2.3 U25.25(XOUT)
$2N4024: Q3.3(C) R51.2 R52.2
$2N4028: Q3.1(B) R50.1

Not connected (* = marked no-connect by the designer): CN1 10*; H8 1* 2* 3*; U3 1(NC)* 2(Reserved)* 4(Reserved)* 5(NC)* 6(NC)* 7(NC)* 8(nRESET)* 9(VCC_RF)* 14(NC)* 15(NC)* 16(TXD2)* 17(RXD2)* 18(SDA)* 19(SCL)*; U5 4(RTS#)*; U8 2(PC13)* 8(PC0)* 9(PC1)* 10(PC2)* 11(PC3)* 14(PA0-WKUP(PA0))* 15(PA1)* 22(PA6)* 24(PC4)* 25(PC5)* 26(PB0)* 27(PB1)* 33(PB12)* 34(PB13)* 35(PB14)* 36(PB15)* 39(PC8)* 40(PC9)* 41(PA8)* 44(PA11)* 45(PA12)* 50(PA15(JTDI))* 53(PC12)* 54(PD2)* 55(PB3(JTDOTRACESWO))* 56(PB4(NJTRST))* 57(PB5)* 61(PB8)* 62(PB9)*; U10 4(NC)*; U16 4(NC)*; U23 3*; U24 3(NC)* 5(NC)* 6(NC)* 7(NC)* 14(NC)*; U25 13(NC)* 14(NC)* 15(NC)*; USB4 A8(SBU1)* B8(SBU2)*

## Notes on the sheets
sheet 1
- usart2
- usart3
- usart1
- usart6
- uart4
